# EAGLE design 2A_Buck_Boost (EAGLE 9.1.1)
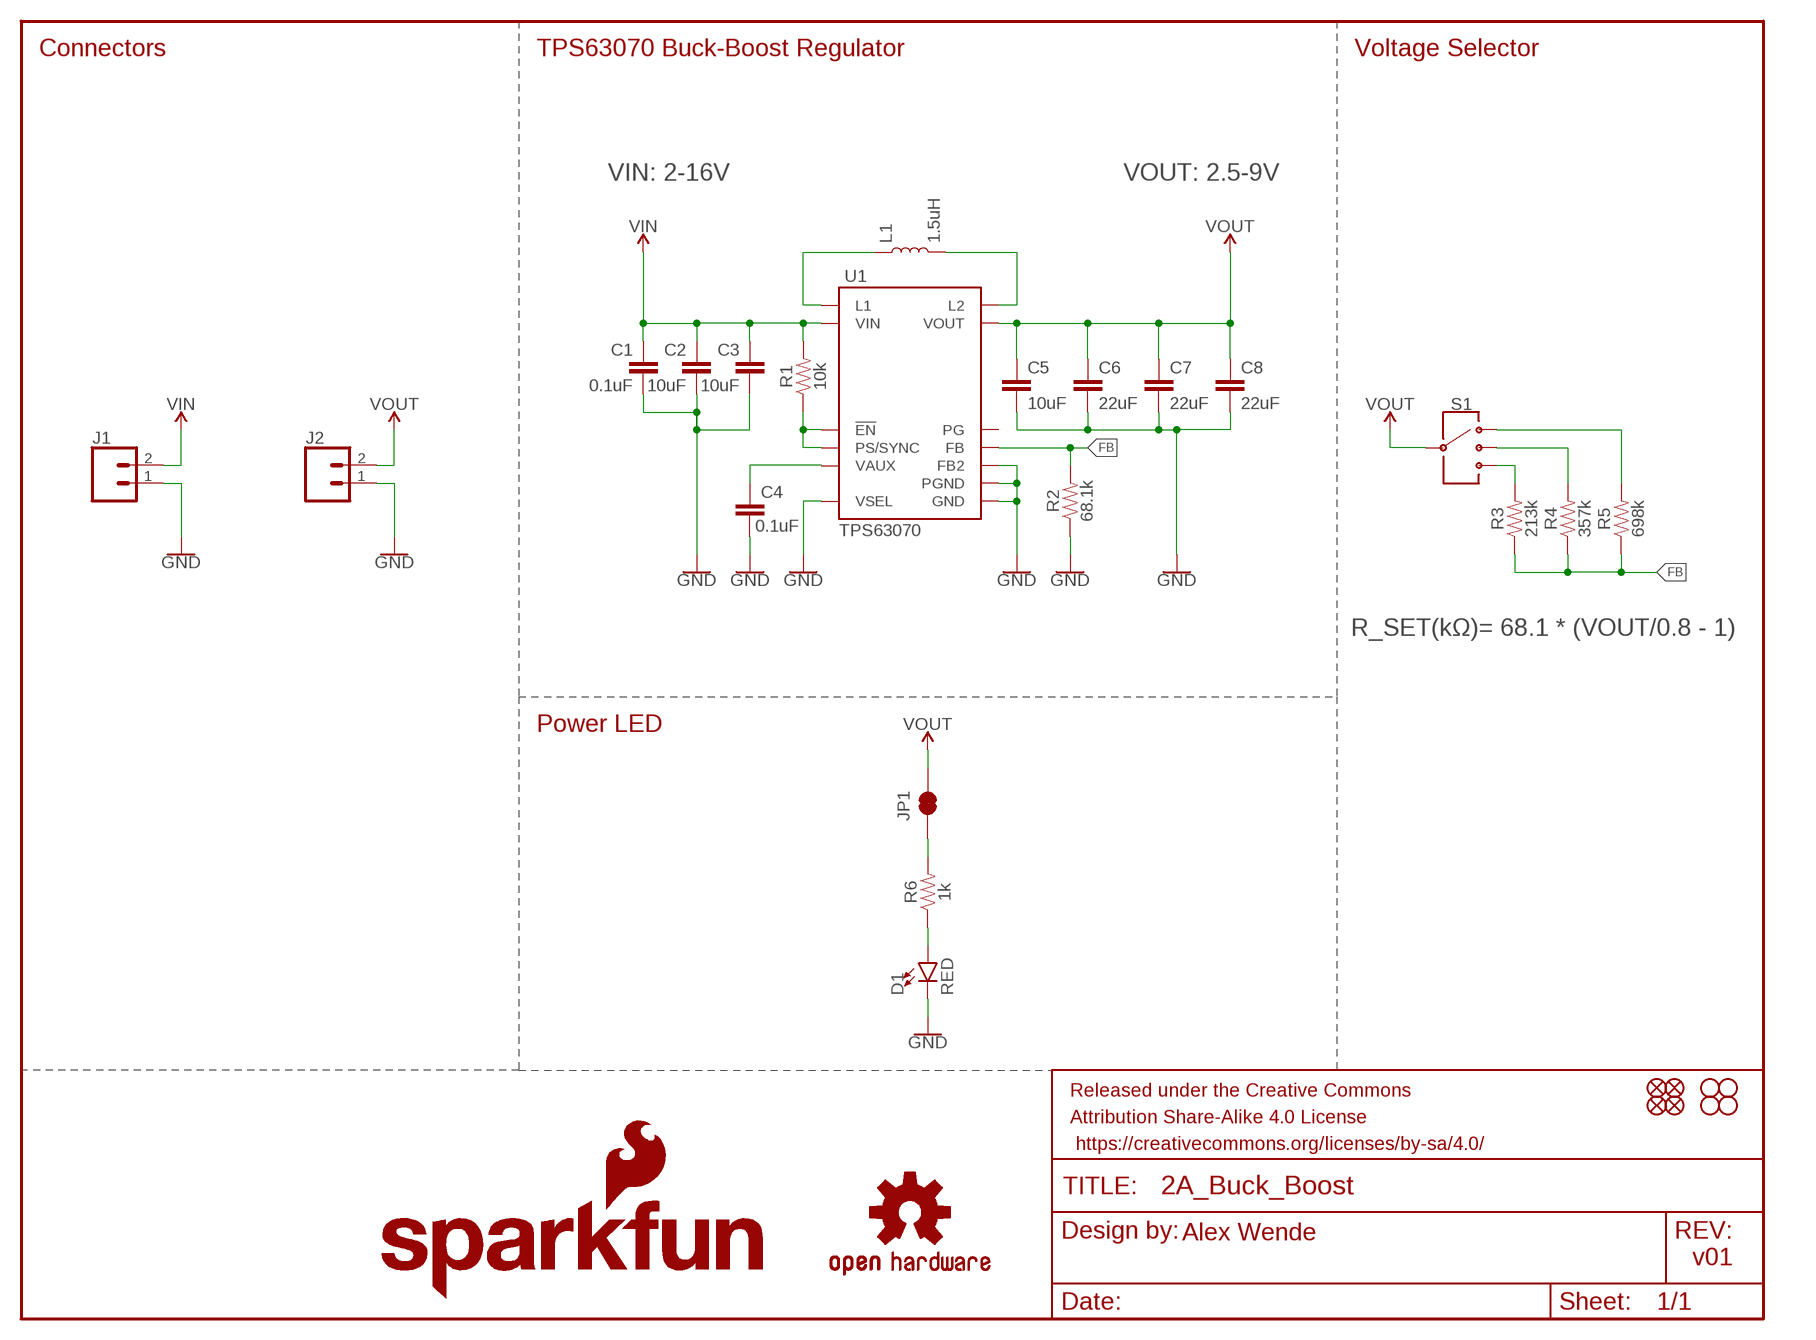
[diagram p0: schematic, sheet 1]

## Parts
C1  0.1uF  0.1UF-0603-25V-(+80/-20%)  [0603]
C2  10uF  10UF-0805-25V-10%  [0805]
C3  10uF  10UF-0805-25V-10%  [0805]
C4  0.1uF  0.1UF-0603-25V-(+80/-20%)  [0603]
C5  10uF  10UF-0805-25V-10%  [0805]
C6  22uF  22UF-0805-16V-20%  [0805]
C7  22uF  22UF-0805-16V-20%  [0805]
C8  22uF  22UF-0805-16V-20%  [0805]
D1  RED  LED-RED0603  [LED-0603]
FD1  FIDUCIAL1X2  [FIDUCIAL-1X2]
FD2  FIDUCIAL1X2  [FIDUCIAL-1X2]
FD3  FIDUCIAL1X2  [FIDUCIAL-1X2]
FD4  FIDUCIAL1X2  [FIDUCIAL-1X2]
FRAME1  FRAME-LETTER  [CREATIVE_COMMONS]
H1  STAND-OFF  [STAND-OFF]
H2  STAND-OFF  [STAND-OFF]
H3  STAND-OFF  [STAND-OFF]
H4  STAND-OFF  [STAND-OFF]
J1  CONN_021X02_NO_SILK  [1X02_NO_SILK]
J2  CONN_021X02_NO_SILK  [1X02_NO_SILK]
JP1  JUMPER-SMT_2_NC_TRACE_NO-SILK  [SMT-JUMPER_2_NC_TRACE_NO-SILK]
L1  1.5uH  INDUCTOR-XFL40201.5UH  [XFL4020]
LOGO1  SFE_LOGO_NAME_FLAME.1_INCH  [SFE_LOGO_NAME_FLAME_.1]
LOGO2  OSHW-LOGOS  [OSHW-LOGO-S]
R1  10k  10KOHM-0603-1/10W-1%  [0603]
R2  68.1k  68.1KOHM-0603-1/10W-1%  [0603]
R3  213k  213KOHM  [0603]
R4  357k  357KOHM  [0603]
R5  698k  698KOHM  [0603]
R6  1k  1KOHM-0603-1/10W-1%  [0603]
S1  SWITCH-SP3T-SMD  [SWITCH_SP3T_SMD]
U1  TPS63070  [VQFN-15-HR(3X2.5)]

## Nets
FB: R2.2 R3.1 R4.1 R5.1 U1.P$5(FB)
GND: C1.2 C2.2 C3.2 C4.2 C5.2 C6.2 C7.2 C8.2 D1.C J1.1 J2.1 R2.1 U1.P$4(GND) U1.P$6(FB2) U1.P$10(PGND) U1.P$15(VSEL)
N$1: L1.P$1 U1.P$11(L1)
N$2: L1.P$2 U1.P$9(L2)
N$3: R1.1 U1.P$1(PS/SYNC) U1.P$14(!EN)
N$4: R5.2 S1.1
N$5: R4.2 S1.2
N$6: C4.1 U1.P$3(VAUX)
N$7: R3.2 S1.4
N$8: JP1.1 R6.2
N$9: D1.A R6.1
VIN: C1.1 C2.1 C3.1 J1.2 R1.2 U1.P$12/13(VIN)
VOUT: C5.1 C6.1 C7.1 C8.1 J2.2 JP1.2 S1.3 U1.P$7/8(VOUT)
Unconnected: U1.P$2(PG)

## Notes on the sheet
- Connectors | TPS63070 Buck-Boost Regulator | Voltage Selector
- VIN: 2-16V | VOUT: 2.5-9V
- R_SET(kΩ)= 68.1 * (VOUT/0.8 - 1)
- Power LED
- Alex Wende
- v01

## Library data of the parts
C1 C4 = SparkFun-Capacitors:0.1UF: 0.1µF ceramic capacitors A capacitor is a passive two-terminal electrical component used to store electrical energy temporarily in an electric field.; PROD_ID: CAP-00810
C2 C3 C5 = SparkFun-Capacitors:10UF: 10.0µF ceramic capacitors A capacitor is a passive two-terminal electrical component used to store electrical energy temporarily in an electric field.; PROD_ID: CAP-14259
C6-C8 = SparkFun-Capacitors:22UF: 22µF ceramic capacitors A capacitor is a passive two-terminal electrical component used to store electrical energy temporarily in an electric field.; PROD_ID: CAP-14260
D1 = SparkFun-LED:LED-RED: Red SMD LED Used in manufacturing of most products at SparkFun Packages: 0603 - SMD 0603 package [Product Link] <http://docs.avagotech.com/docs/AV02-0551EN> 0603 SMART - SMD 0603 SMART package ( more efficient and expensive)[Product Link] <http://www.osram-os.com/Graphics/XPic2/00077099_0.pdf> 1206 - SMD1206 package [Product Link] <https://www.sparkfun.com/datasheets/DevTools/LilyPad/Q150OVS4.pdff> SparkFun Products: Pro Mini 328 -5V <https://www.sparkfun.com/products/821> RedBoard <https://www.sparkfun.com/products/12757> IOIO-OTG <https://www.sparkfun.com/products/13613>; PROD_ID: DIO-00819
FD1-FD4 = SparkFun-Aesthetics:FIDUCIAL: Fiducial Alignment Points Point-of-reference for pick-and-place machines and other optical instruments.
FRAME1 = SparkFun-Aesthetics:FRAME-LETTER: Schematic Frame - Letter Standard 8.5x11 US Letter frame
H1-H4 = SparkFun-Hardware:STAND-OFF: Stand Off Drill holes for mechanically mounting via screws, standoffs, etc. Note: Use the keepout ring to avoid running the screw head into surrounding components. Variant Overviews STAND-OFF - Mechanical footprint for a #4 phillips button head screw. STAND-OFF-TIGHT - Mechanical footprint for a #4 phillips button head screw, Example SparkFun Products Screw - Phillips Head (1/4", 4-40, 10 pack) <https://www.sparkfun.com/products/10453> (PRT-10453) Screw - Phillips Head (1/2", 4-40, 10 pack) <https://www.sparkfun.com/products/10452> (PRT-10452) Screw - Phillips Head (3/4", 4-40, 10 pack) <https://www.sparkfun.com/products/10451> (PRT-10451) Screw - Phillips Head (1", 4-40, 10 pack) <https://www.sparkfun.com/products/10450> (PRT-10450)
J1 J2 = SparkFun-Connectors:CONN_02: Multi connection point. Often used as Generic Header-pin footprint for 0.1 inch spaced/style header connections On any of the 0.1 inch spaced packages, you can populate with these: Break Away Headers - Straight <https://www.sparkfun.com/products/116> (PRT-00116) Break Away Male Headers - Right Angle <https://www.sparkfun.com/products/553> (PRT-00553) Female Headers <https://www.sparkfun.com/products/115> (PRT-00115) Break Away Headers - Machine Pin <https://www.sparkfun.com/products/117> (PRT-00117) Break Away Female Headers - Swiss Machine Pin <https://www.sparkfun.com/products/743> (PRT-00743) For SCREWTERMINALS and SPRING TERMINALS visit here: Screw Terimnals on SparkFun.com <https://www.sparkfun.com/search/results?term=Screw+Terminals> (5mm/3.5mm/2.54mm spacing) This device is also useful as a general connection point to wire up your design to another part of your project. Our various solder wires solder well into these plated through hole pads. Hook-Up Wire - Assortment (Stranded, 22 AWG) <https://www.sparkfun.com/products/11375> (PRT-11375) Hook-Up Wire - Assortment (Solid Core, 22 AWG) <https://www.sparkfun.com/products/11367> (PRT-11367) View the entire wire category on our website here <https://www.sparkfun.com/categories/141> Special notes: Molex polarized connector foot print use with: PRT-08233 with associated crimp pins and housings. 2.54_SCREWTERM for use with PRT-10571. 3.5mm Screw Terminal footprints for PRT-08084 5mm Screw Terminal footprints for use with PRT-08432
JP1 = SparkFun-Jumpers:JUMPER-SMT_2_NC_TRACE: Normally closed trace jumper This jumper has a trace between two pads so it's normally closed (NC). Use a razor knife to open the connection. For best results follow the IPC guidelines for cutting traces: Cutout at least 0.063 mm (0.005 in). Remove all loose material to clean up the cut area. Seal the cut with an approved epoxy. Reapply solder to reclose the connection.
L1 = SparkFun-Coils:INDUCTOR-XFL4020; PROD_ID: INDUC-13855
LOGO1 = SparkFun-Aesthetics:SFE_LOGO_NAME_FLAME: SparkFun Font Logo w/ Flame This is the SparkFun full logo. The logo on the schematic will always be the same size; the package variant is the height of the flame part of the logo. Default layer for the logo on the board is tSilk.
LOGO2 = SparkFun-Aesthetics:OSHW-LOGO: Open-Source Hardware (OSHW) Logo This logo indicates the piece of hardware it is found on incorporates a OSHW license and/or adheres to the definition of open source hardware found here: http://freedomdefined.org/OSHW
R1 = SparkFun-Resistors:10KOHM: 10kΩ resistor A resistor is a passive two-terminal electrical component that implements electrical resistance as a circuit element. Resistors act to reduce current flow, and, at the same time, act to lower voltage levels within circuits. - Wikipedia; PROD_ID: RES-00824
R2 = SparkFun-Resistors:68.1KOHM: 68.1kΩ resistor A resistor is a passive two-terminal electrical component that implements electrical resistance as a circuit element. Resistors act to reduce current flow, and, at the same time, act to lower voltage levels within circuits. - Wikipedia; PROD_ID: RES-09380
R3 = SparkFun-Resistors:213KOHM; PROD_ID: RES-14261
R4 = SparkFun-Resistors:357KOHM; PROD_ID: RES-14262
R5 = SparkFun-Resistors:698KOHM; PROD_ID: RES-14263
R6 = SparkFun-Resistors:1KOHM: 1kΩ resistor A resistor is a passive two-terminal electrical component that implements electrical resistance as a circuit element. Resistors act to reduce current flow, and, at the same time, act to lower voltage levels within circuits. - Wikipedia; PROD_ID: RES-07856
S1 = SparkFun-Switches:SWITCH-SP3T: Single-Pole, Triple-Throw (SP3T) Switch Single-Pole, Triple-Throw switches SparkFun Products Prototype Part; PROD_ID: SWCH-10805
U1 = SparkFun-IC-Power:TPS63070; PROD_ID: IC-14258

## Board
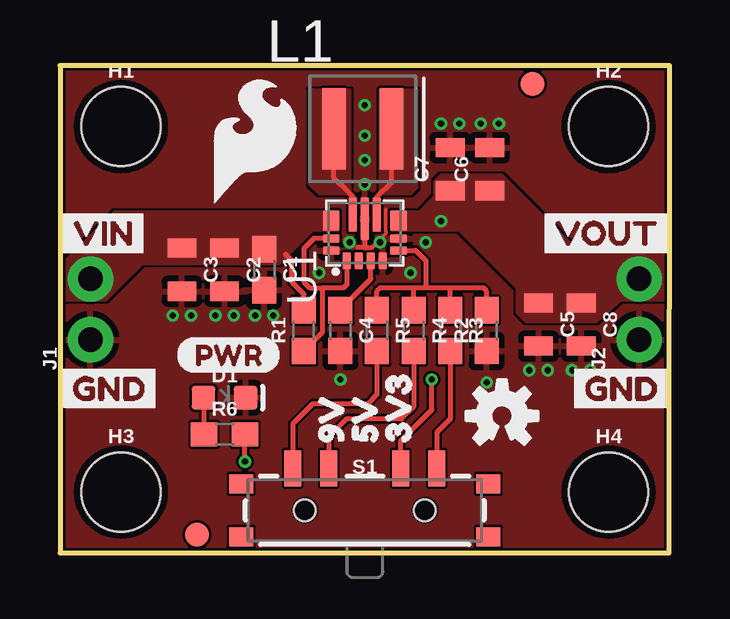
[diagram p1: board, top side]
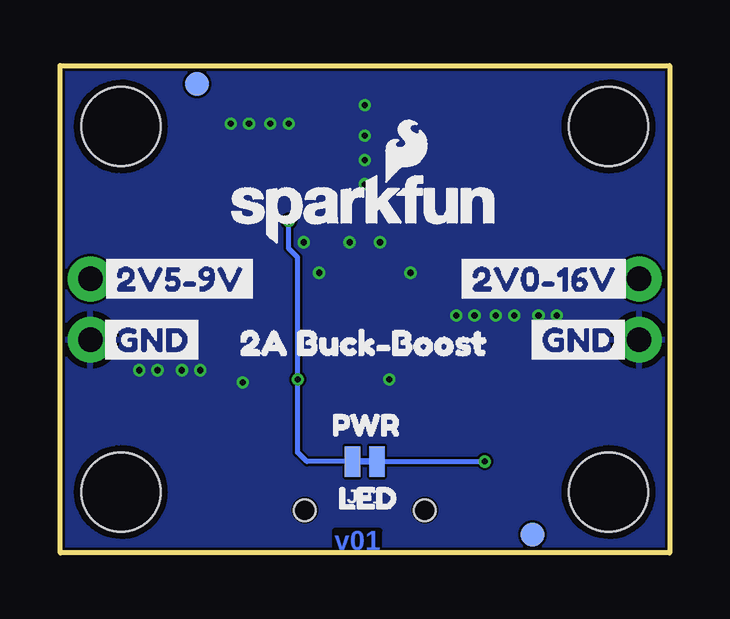
[diagram p2: board, bottom side, seen from below]

Size 25.4 x 20.32 mm. Coordinates in mm from the lower left corner, seen from the top.
Outline: 0,0 25.38,0 25.4,20.32 0,20.32 0,0
Copper layers (1*16): Top 0.035mm / dielectric 1.5mm / Bottom 0.035mm
Design rules "SparkFun-2-layer-FAB-LIMIT": minimum track width 4mil, minimum drill 6mil, track to track 4mil, track to pad 4mil, pad to pad 4mil, via to via 4mil, smd to smd 4mil, copper to edge 4mil, drill to drill 4mil, minimum pad ring 5mil, minimum via ring 5mil, stop-mask expansion 4mil, vias tented up to drill 25mil, thermal gap 10mil

### Footprints (pad centres in the part's own frame; a part is rotated, then mirrored left to right if it is on the bottom)
0603 = smd 1.1 x 1: 1 -0.85,0; 2 0.85,0
0805 = smd 0.8 x 1.2: 1 -0.9,0; 2 0.9,0
LED-0603 = smd 1 x 1: A -0.877,0; C 0.877,0
FIDUCIAL-1X2 = smd 1 x 1: 1 0,0
STAND-OFF = hole 3.302: 0,0
1X02_NO_SILK = drill 1.016 pad 1.88: 1 0,0; 2 2.54,0
SMT-JUMPER_2_NC_TRACE_NO-SILK = smd 0.635 x 1.27: 1 -0.508,0; 2 0.508,0
XFL4020 = smd 0.98 x 3.4: P$1 1,1.8; P$2 3.4,1.8
SWITCH_SP3T_SMD = smd 0.7 x 1.5: 1 3,-1.75; 2 1.5,-1.75; 3 -1.5,-1.75; 4 -3,-1.75 | smd 1 x 0.8: P$1 -5.15,-1.1; P$2 -5.15,1.1; P$3 5.15,1.1; P$4 5.15,-1.1 | hole 0.9: 2.5,0; -2.5,0
VQFN-15-HR(3X2.5) = smd 0.7 x 0.35: P$1 -1.15,0.75; P$2 -1.15,0.25; P$3 -1.15,-0.25; P$4 -1.15,-0.75 | smd 0.35 x 0.7: P$5 -0.725,-1.4; P$6 -0.225,-1.4; P$14 -0.225,1.4; P$15 -0.725,1.4 | smd 0.85 x 0.7: P$7/8 0.525,-1.4; P$12/13 0.525,1.4 | smd 1.45 x 0.35: P$9 0.775,-0.5; P$11 0.775,0.5 | smd 1.8 x 0.35: P$10 0.6,0

### Placement (x,y rotation side)
C1  8.51,11.81 270 top
C2  6.86,11.81 270 top
C3  5.08,11.81 270 top
C4  11.68,9.27 270 top
C5  19.94,9.53 270 top
C6  17.91,16 90 top
C7  16.26,16 90 top
C8  21.72,9.53 270 top
D1  6.86,6.48 0 top
FD1  19.68,19.56 0 top
FD2  19.68,19.56 0 bottom
FD3  5.71,0.76 0 top
FD4  5.71,0.76 0 bottom
FRAME1  -13.97,-16.51 0 top  (outside the outline)
H1  2.54,17.78 0 top
H2  22.86,17.78 0 top
H3  2.54,2.54 0 top
H4  22.86,2.54 0 top
J1  1.27,8.89 90 top
J2  24.13,8.89 90 top
JP1  12.7,3.81 180 bottom
L1  10.41,15.88 0 top
LOGO1  12.7,14.35 0 bottom
LOGO2  18.41,5.71 0 top
R1  10.16,9.27 90 top
R2  17.78,9.27 90 top
R3  16.26,9.27 270 top
R4  14.73,9.27 270 top
R5  13.21,9.27 270 top
R6  6.86,4.95 0 top
S1  12.7,1.78 180 top
U1  12.7,13.34 90 top
U$1  [PWR2]  4.83,8.26 0 top
U$2  [3V33]  14.1,3.68 90 top
U$3  [5V2]  12.7,3.68 90 top
U$4  [9V0]  11.3,3.68 90 top
U$5  [VIN3]  -0.38,13.34 0 top
U$6  [GND4]  -0.38,6.86 0 top
U$7  [GND4]  20.95,6.86 0 top
U$8  [VOUT5]  19.68,13.34 0 top
U$9  [SFE_LOGO_FLAME_.2]  8.13,17.14 0 top
U$10  [2V0#16V2]  9.14,11.43 0 bottom
U$11  [PWR1]  14.86,5.33 0 bottom
U$12  [GND4]  6.22,8.89 0 bottom
U$13  [GND4]  24,8.89 0 bottom
U$14  [2V5#9V1]  24,11.43 0 bottom
U$15  [2A_BUCK#BOOST0]  18.8,8.76 0 bottom
U$16  [LED0]  14.61,2.29 0 bottom

### Tracks (layer width: path | path; a pad name or v marks a point on that pad's centre or on a via)
FB
  Top 0.203: R5.1 13.21,10.92 13.34,11.05 13.97,11.05 14.73,11.05 | R2.2 17.78,10.92 17.65,11.05 16.26,11.05 | 16.26,11.05 15.24,11.05 | 15.24,11.05 14.73,11.05 | R4.1 14.73,11.05 | R3.1 16.26,11.05 | U1.P$5 14.82,12.61 15.24,12.19 15.24,11.05
GND  (via drill 0.25)
  Top 0.152: 12.99,12.74 13.59,13.34 13.59,13.38 13.57,13.39 13.57,14.33
  Top 0.203: U1.P$10 12.7,12.74 | 12.7,12.74 12.99,12.74 | 12.7,12.74 12.41,12.74
  other vias: 12.7,15.37 10.79,11.68 12.7,16.38 12.7,17.4 12.7,18.67 15.88,17.91 16.64,17.91 7.24,9.91 6.48,9.91 5.46,9.91 4.7,9.91 17.53,17.91 18.29,17.91 22.1,7.62 21.34,7.62 14.61,11.68 15.24,12.95 19.56,7.62 20.32,7.62 8.13,9.91 8.89,9.91 11.68,7.24 17.78,7.11 12.06,12.95 13.34,12.95
  pour Top (rank 2): 0,0 0,20.32 25.4,20.32 25.4,0
  pour Bottom (rank 2): 0,0 0,20.32 25.4,20.32 25.4,0
N$1
  Top 0.203: L1.P$1 11.41,15.64 12.06,14.99 12.2,14.85 U1.P$11
  pour Top (no thermals): 10.41,19.3 12.06,19.3 12.06,14.99 10.79,14.99 10.41,15.37
N$2
  Top 0.203: U1.P$9 13.2,14.85 13.81,15.46 L1.P$2
  pour Top (no thermals): 13.34,19.3 14.86,19.3 14.86,15.24 14.61,14.99 13.34,14.99
N$3
  Top 0.203: R1.1 10.92,9.18 10.92,11.05 | U1.P$14 10.57,13.11 10.16,12.7 10.16,11.3 10.41,11.05 10.92,11.05 | U1.P$1 11.95,11.19 11.81,11.05 10.92,11.05
N$4
  Top 0.203: R5.2 13.21,6.6 12.83,6.22 10.54,6.22 9.7,5.38 S1.1
N$5
  Top 0.203: R4.2 14.73,6.1 14.22,5.59 11.94,5.59 11.2,4.85 S1.2
N$6
  Top 0.203: C4.1 11.68,10.16 12.95,11.43 U1.P$3
N$7
  Top 0.203: R3.2 16.26,5.59 15.7,5.03 S1.4
N$8  (via drill 0.25)
  Top 0.203: v7.71,3.81 7.71,3.98 R6.2
  Bottom 0.203: JP1.1 7.87,3.81 v7.71,3.81
N$9
  Top 0.203: D1.A 5.98,4.98 R6.1
VIN
  Top 0.203: R1.2 10.16,10.79 9.65,11.3 9.65,12.19 9.4,12.45
  pour Top (no thermals): 0,11.94 2.29,14.22 11.56,14.22 11.56,13.46 10.54,13.46 9.14,12.06 3.43,12.06 1.91,10.54 0,10.54
VOUT  (via drill 0.25)
  Top 0.203: S1.3 14.2,4.67 15.49,5.97 v15.49,7.24
  Bottom 0.203: v15.88,13.84 15.88,12.7 15.49,12.32 v15.49,7.24 15.49,4.19 15.11,3.81 JP1.2
  pour Top (no thermals): 13.84,13.46 13.84,14.22 14.99,14.22 15.62,14.86 15.62,15.49 15.88,15.75 18.41,15.75 21.72,12.45 25.4,12.45 25.4,10.54 23.37,10.54 22.35,9.65 19.43,9.65 19.05,10.03 19.05,11.05 16.64,13.46

### Text on the board
Bottom: v01
tDocu: Alex Wende